# EAGLE design AloyseTech-ELVN-RevA (EAGLE 9.3.2)
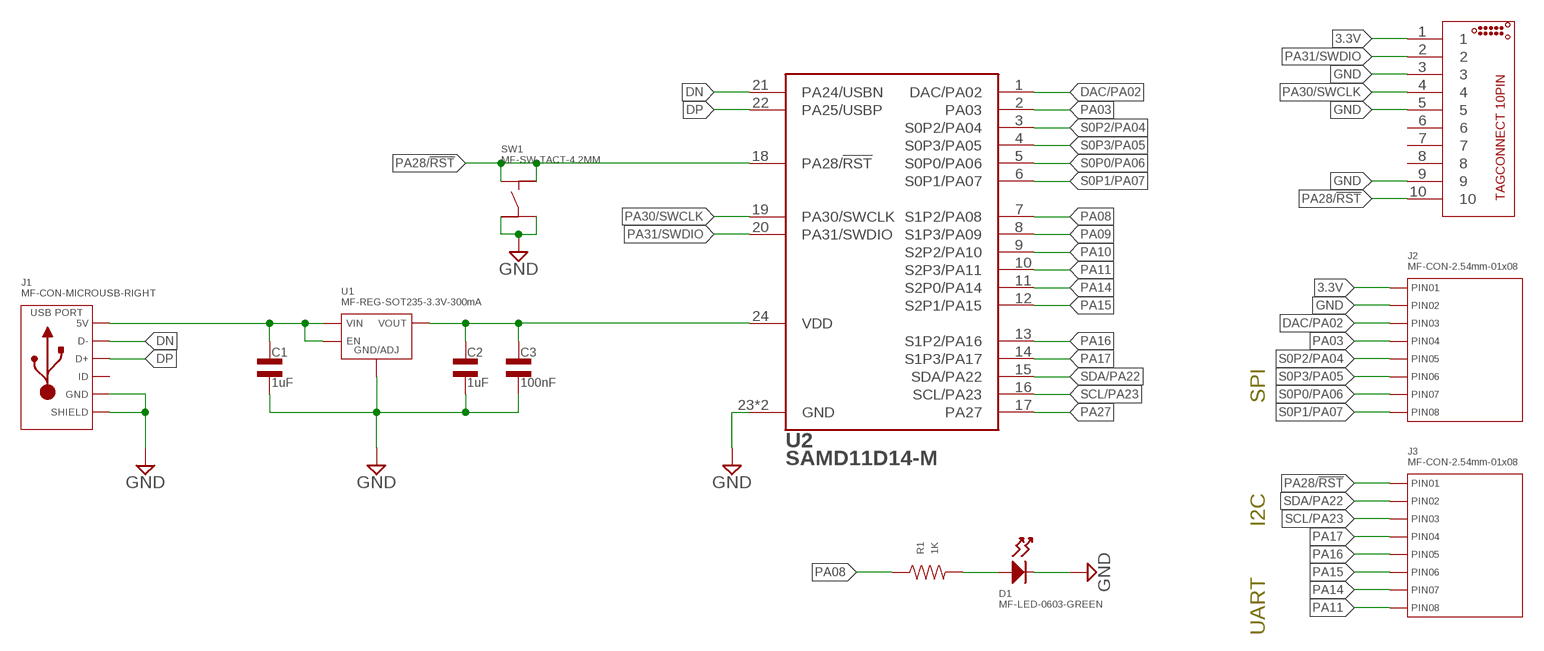
[diagram p0: schematic, sheet 1]

## Parts
C1  1uF  CAPACITOR-NP-COG-10V-0805  [0805]
C2  1uF  CAPACITOR-NP-COG-10V-0805  [0805]
C3  100nF  CAPACITOR-NP-COG-10V-0402  [0402]
D1  MF-LED-0603-GREEN  LED_SINGLE-0603-GREEN  [LED0603]
J1  MF-CON-MICROUSB-RIGHT  USB_MICRO_RIGHT  [MICROUSB-RIGHT]
J2  MF-CON-2.54mm-01x08  CON_01X08_PTH_2.54MM  [PTH_2.54MM_01X08]
J3  MF-CON-2.54mm-01x08  CON_01X08_PTH_2.54MM  [PTH_2.54MM_01X08]
J4  TC2050-COMBO-NC  [TC2050-10PIN1.27MM-COMBO-NC]
R1  1K  RESISTOR_0402  [R0402]
SW1  MF-SW-TACT-4.2MM  TACT_4.2MM  [TACT4.2MM]
U1  MF-REG-SOT235-3.3V-300mA  TLV70233PDBVR  [SOT-23-5]
U2  SAMD11D14-M  [QFN50P400X400X90-25T275]

## Nets
3.3V: C2.1 C3.1 J2.P$1(PIN1) J4.1 U1.P$5(VOUT) U2.24(VDD)
DAC/PA02: J2.P$3(PIN3) U2.1(DAC/PA02)
DN: J1.2(D-) U2.21(PA24/USBN)
DP: J1.3(D+) U2.22(PA25/USBP)
GND: C1.2 C2.2 C3.2 D1.CATHODE J1.5(GND) J1.S1(SLD) J1.S2(SLD) J1.S3(SLD) J1.S4(SLD) J1.S5(SLD) J1.S6(SLD) J2.P$2(PIN2) J4.3 J4.5 J4.9 SW1.P$3 SW1.P$4 U1.P$2(GND/ADJ) U2.23(GND) U2.25(GND)
N$1: D1.ANODE R1.P$2
PA03: J2.P$4(PIN4) U2.2(PA03)
PA08: R1.P$1 U2.7(S1P2/PA08)
PA09: U2.8(S1P3/PA09)
PA10: U2.9(S2P2/PA10)
PA11: J3.P$8(PIN8) U2.10(S2P3/PA11)
PA14: J3.P$7(PIN7) U2.11(S2P0/PA14)
PA15: J3.P$6(PIN6) U2.12(S2P1/PA15)
PA16: J3.P$5(PIN5) U2.13(S1P2/PA16)
PA17: J3.P$4(PIN4) U2.14(S1P3/PA17)
PA27: U2.17(PA27)
PA28/!RST!: J3.P$1(PIN1) J4.10 SW1.P$1 SW1.P$2 U2.18(PA28/!RST!)
PA30/SWCLK: J4.4 U2.19(PA30/SWCLK)
PA31/SWDIO: J4.2 U2.20(PA31/SWDIO)
S0P0/PA06: J2.P$7(PIN7) U2.5(S0P0/PA06)
S0P1/PA07: J2.P$8(PIN8) U2.6(S0P1/PA07)
S0P2/PA04: J2.P$5(PIN5) U2.3(S0P2/PA04)
S0P3/PA05: J2.P$6(PIN6) U2.4(S0P3/PA05)
SCL/PA23: J3.P$3(PIN3) U2.16(SCL/PA23)
SDA/PA22: J3.P$2(PIN2) U2.15(SDA/PA22)
VBUS: C1.1 J1.1(5V) U1.P$1(VIN) U1.P$3(EN)
Unconnected: J1.4(ID) J4.6 J4.7 J4.8

## Notes on the sheet
- SPI
- I2C
- UART

## Library data of the parts
C1 C2 = Generics_stg:CAPACITOR-NP; CLASS: COG; PACKAGE: 0805; POPULATE: 1; TOLERANCE: xx %; VOLTAGE: 10V
C3 = Generics_stg:CAPACITOR-NP; CLASS: COG; PACKAGE: 0402; POPULATE: 1; TOLERANCE: xx %; VOLTAGE: 10V
D1 = MF_LEDs:LED_SINGLE: Library: MF_LEDs Description: Device for Single LED Packages. Manufacture part number (MFG#) can be added via Attributes.; HOUSEPART: YES; MPN: MF-LED-0603-GREEN; POPULATE: 1; URL: https://factory.macrofab.com/part/MF-LED-0603-GREEN
J1 = MF_Connectors:USB: Library: MF_Connectors Description: 5 Pin USB Connectors. SLD is the shield connection. Usually tied to ground through a small ferrite bead.; HOUSEPART: YES; MPN: MF-CON-MICROUSB-RIGHT; POPULATE: 1; URL: https://factory.macrofab.com/part/MF-CON-MICROUSB-RIGHT
J2 J3 = MF_Connectors:CON_01X08: Library: MF_Connectors Description: Header Connector with 8 Positions and 01 Rows. Use the LABEL Attribute to label the pin on the schematic and PCB. You can remove the attributes on the PCB by using the SMASH function on the part and then deleting the text.; HOUSEPART: YES; MPN: MF-CON-2.54mm-01x08; POPULATE: 1; URL: https://factory.macrofab.com/part/MF-CON-2.54mm-01x08
J4 = TagConnect_stg:TC2050
R1 = MF_Passives:RESISTOR: Library: MF_Passives Description: Device for Resistors. Manufacture part number (MPN), Voltage, Tolerance, and Wattage Rating can be added via Attributes. Check https://factory.macrofab.com/parts for the house parts list.; POPULATE: 1
SW1 = MF_Switches:TACT: Library: MF_Switches Description: Device for Tact Switches. Manufacture part number (MFG#) can be added via Attributes.; HOUSEPART: YES; MPN: MF-SW-TACT-4.2MM; POPULATE: 1; URL: https://factory.macrofab.com/part/MF-SW-TACT-4.2MM
U1 = MF_IC_Power:TLV702: Manufacturer Part #: TLV702 Manufacturer: Texas Instruments Description: LDO Voltage Regulators; HOUSEPART: YES; MPN: MF-REG-SOT235-3.3V-300mA; POPULATE: 1; URL: https://factory.macrofab.com/part/MF-REG-SOT235-3.3V-300mA
U2 = MICROCHIP:SAMD11D14-M

## Board
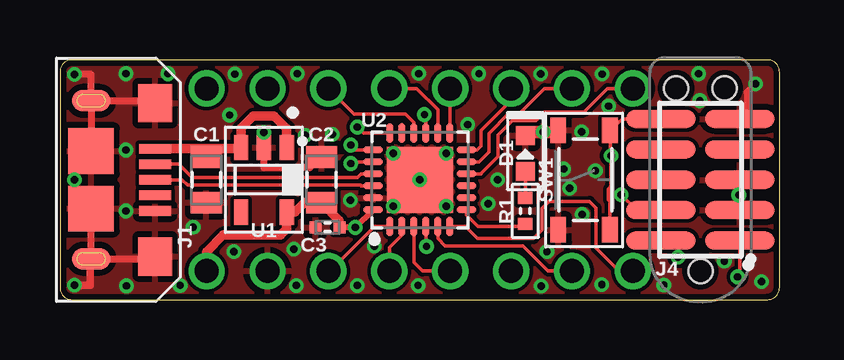
[diagram p1: board, top side]
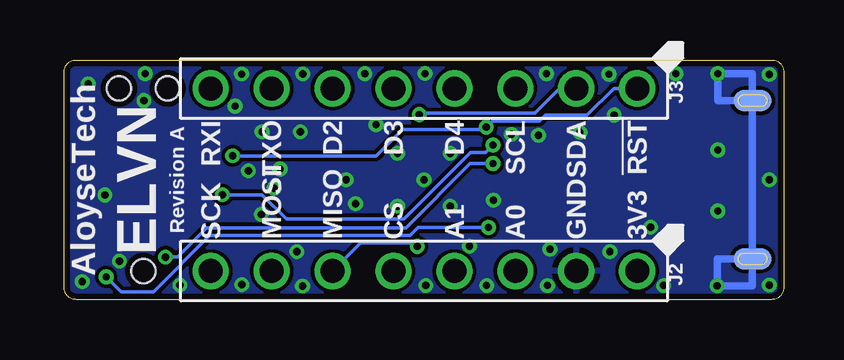
[diagram p2: board, bottom side, seen from below]

Size 30 x 10 mm. Coordinates in mm from the lower left corner, seen from the top.
Outline: 0,9.5 0,0.5 arc90 0.5,0 29.5,0 arc90 30,0.5 30,9.5 arc90 29.5,10 0.5,10 arc90 0,9.5
Copper layers (1*16): Top 0.035mm / dielectric 1.5mm / Bottom 0.035mm
Design rules "SeeedStudio_2layer_DRU_no_angle_20140221": minimum track width 6mil, minimum drill 12mil, track to track 6mil, track to pad 6mil, pad to pad 6mil, via to via 6mil, smd to smd 0mil, copper to edge 10mil, drill to drill 10mil, minimum pad ring 10mil, minimum via ring 6mil, stop-mask expansion 2mil, vias tented up to drill 100mil, thermal gap 10mil

### Footprints (pad centres in the part's own frame; a part is rotated, then mirrored left to right if it is on the bottom)
0805 = smd 0.9 x 1.3: 1 -0.95,0; 2 0.95,0
0402 = smd 0.5 x 0.5: 1 -0.5,0; 2 0.5,0
LED0603 = smd 0.8 x 0.8: ANODE 0.75,0; CATHODE -0.75,0
MICROUSB-RIGHT = smd 0.4 x 1.35: 1 -1.3,1.27; 2 -0.65,1.27; 3 0,1.27; 4 0.65,1.27; 5 1.3,1.27 | smd 0.9 x 1.6: S1 -3.3,-1.4; S2 3.3,-1.4 | smd 1.6 x 1.4: S3 -3.2,1.27; S4 3.2,1.27 | smd 1.9 x 1.9: S5 -1.2,-1.405; S6 1.2,-1.405 | smd 0.9 x 1.6 bottom: S7 -3.3,-1.4; S8 3.3,-1.4
PTH_2.54MM_01X08 = drill 1: P$1 -8.89,0; P$2 -6.35,0; P$3 -3.81,0; P$4 -1.27,0; P$5 1.27,0; P$6 3.81,0; P$7 6.35,0; P$8 8.89,0
TC2050-10PIN1.27MM-COMBO-NC = smd 0.75 x 2.9: 1 -2.54,-1.65; 2 -2.54,1.65; 3 -1.27,-1.65; 4 -1.27,1.65; 5 0,-1.65; 6 0,1.65; 7 1.27,-1.65; 8 1.27,1.65; 9 2.54,-1.65; 10 2.54,1.65 | hole 1: -3.81,0; 3.81,-1.016; 3.81,1.016
R0402 = smd 0.5 x 0.6: P$1 -0.55,0; P$2 0.55,0
TACT4.2MM = smd 1.05 x 0.65: P$1 -2.075,1.075; P$2 2.075,1.075; P$3 -2.075,-1.075; P$4 2.075,-1.075
SOT-23-5 = smd 1.05 x 0.6: P$1 -1.35,0.95; P$2 -1.35,0; P$3 -1.35,-0.95; P$4 1.35,-0.95; P$5 1.35,0.95
QFN50P400X400X90-25T275 = smd 0.811 x 0.264: 1 -1.951,1.25; 2 -1.951,0.75; 3 -1.951,0.25; 4 -1.951,-0.25; 5 -1.951,-0.75; 6 -1.951,-1.25; 13 1.951,-1.25; 14 1.951,-0.75; 15 1.951,-0.25; 16 1.951,0.25; 17 1.951,0.75; 18 1.951,1.25 | smd 0.264 x 0.811: 7 -1.25,-1.951; 8 -0.75,-1.951; 9 -0.25,-1.951; 10 0.25,-1.951; 11 0.75,-1.951; 12 1.25,-1.951; 19 1.25,1.951; 20 0.75,1.951; 21 0.25,1.951; 22 -0.25,1.951; 23 -0.75,1.951; 24 -1.25,1.951 | smd 2.75 x 2.75: 25 0,0

### Placement (x,y rotation side)
C1  6.1,5 270 top
C2  10.9,5 90 top
C3  11.15,3.01 180 top
D1  19.4,6.1 270 top
J1  2.7,5 270 top
J2  15,1.19 180 bottom
J3  15,8.81 180 bottom
J4  26.7,5 90 top
R1  19.4,3.7 90 top
SW1  21.85,4.99 270 top
U1  8.5,5 270 top
U2  15,5 90 top

### Tracks (layer width: path | path; a pad name or v marks a point on that pad's centre or on a via)
3.3V  (via drill 0.3)
  Top 0.152: J4.1 28.35,1.05 v28.25,0.95
  Top 0.254: 11.2,3.75 C2.1 | U2.24 v12.31,3.01 C3.1
  Top 0.4: C3.1 11.64,3.31 C2.1 10.2,4.05 9.8,3.65 U1.P$5 9.45,2.95 9.19,2.69 6.81,2.69 6.11,1.99 J2.P$1
  Bottom 0.152: v28.25,0.95 27.63,0.33 26.27,0.33 23.93,2.67 15.58,2.67 15.24,3.01 v12.31,3.01
DAC/PA02
  Top 0.152: U2.1 13.12,3.05 11.27,1.19 J2.P$3
DN
  Top 0.152: U2.21 12.55,5.25 12.4,5.1 5.5,5.1 4.95,5.65 J1.2
DP
  Top 0.152: J1.3 5.1,5 5.33,4.78 12.52,4.78 12.55,4.75 U2.22
GND  (via drill 0.3)
  Top 0.3: J1.S6 J1.S2 3.87,1.7 J1.S4 | J1.S1 | J1.S1 1.4,8.2 | J1.S1 3.87,8.3 J1.S3 | J1.S1 J1.S5 | J1.S1 1.3,9.4 v0.6,9.4 | J4.9 28.65,7.54 28.65,8.65 v29,9 | C2.2 10.87,5.95 10.42,5.5 8.5,5.5 U1.P$2
  Top 0.305: v0.6,0.6 1.25,0.6 1.25,1.7 J1.S2
  Top 0.4: U1.P$2 v8.5,6.97
  Top 0.508: D1.CATHODE 19.55,7 20.05,7 20.06,7 v20.15,7 20.71,7 SW1.P$3
  Bottom 0.305: J1.S2 1.3,0.58 v2.77,0.58 2.77,1.7 J1.S2 | J1.S1 1.3,9.43 v2.75,9.43 2.75,8.3 J1.S1 | J1.S1 J1.S2
  other vias: 21.25,4.65 12.1,4.15 15,5 13.9,6.1 16.1,6.1 16.1,3.9 13.9,3.9 5.55,3.02 28.3,4.37 21.75,7 22.88,8.07 20.05,9.42 22.6,9.41 26.62,9.43 17.46,9.43 14.96,9.43 9.89,9.43 7.29,9.41 4.5,9.43 0.6,5 20.06,0.57 22.59,0.62 25.18,0.6 17,7.3 18.25,5 29.25,0.75 27.7,1.6 21.77,3.55 22.32,5.38 21,5.45 26.68,8.3 17.85,4 13.1,2.23 9.75,2.1 7.25,2 7.08,7.7 2.75,3.7 10.22,6.85 11.35,6.9 20.3,2 14.93,0.59 12.39,0.59 9.85,0.59 5.01,0.59 2.75,6.24
  pour Top: -3,13 33,13 33,-3 -3,-3
  pour Bottom: -2,12 32,12 32,-2 -2,-2
N$1
  Top 0.152: D1.ANODE R1.P$2
PA03
  Top 0.152: U2.2 14.25,2.7 13.73,2.18 J2.P$4
PA08
  Top 0.152: U2.7 16.95,3.52 17.43,3.05 19.3,3.05 R1.P$1
PA11
  Top 0.152: U2.10 17.55,5.25 18.25,5.96 18.25,6.87 18.87,7.48 19.85,7.48 20.2,7.83 21.84,7.83 22.82,8.81 J3.P$8
PA14
  Top 0.152: U2.11 17.48,5.75 17.88,6.15 17.88,6.93 18.73,7.78 19.18,7.78 20.2,8.81 J3.P$7
PA15
  Top 0.152: U2.12 17.4,6.25 17.55,6.4 17.55,7.05 18.81,8.31 J3.P$6
PA16
  Top 0.152: U2.13 16.25,8.79 J3.P$5
PA17
  Top 0.152: U2.14 15.75,7.92 14.87,8.81 J3.P$4
PA27
  Top 0.152: U2.17 14.25,7.3
PA28/!RST!  (via drill 0.3)
  Top 0.152: U2.18 12.65,6.95 v12.4,7.2 | J4.10 23.44,7.54 SW1.P$1 v22.98,6 22.98,4.73 22.87,4.62 22.87,4.15 22.93,4.1 SW1.P$2
  Bottom 0.152: v22.98,6 17,6 15.9,7.1 12.5,7.1 v12.4,7.2 12.15,7.45 10.18,7.45 9.93,7.7 8.2,7.7 7.09,8.81 J3.P$1
PA30/SWCLK  (via drill 0.3)
  Top 0.152: U2.19 12.32,6.25 v12.12,6.45 | J4.4 24.05,3.73 v23.4,4.38
  Bottom 0.152: v12.12,6.45 12.44,6.13 13.06,6.13 15.84,3.35 20.73,3.35 21.75,4.38 v23.4,4.38
PA31/SWDIO  (via drill 0.3)
  Top 0.152: U2.20 12.12,5.75 v12.12,5.67 | v25.77,1.77 25.77,2.23 25.54,2.46 J4.2
  Bottom 0.152: v12.12,5.67 13.07,5.67 15.75,3 24.05,3 25.27,1.77 v25.77,1.77
S0P0/PA06
  Top 0.152: U2.5 15.75,2.55 16.06,2.24 19.3,2.24 20.35,1.19 J2.P$7
S0P1/PA07
  Top 0.152: U2.6 16.9,3.05 17.4,2.55 19.75,2.55 20.1,2.9 20.1,3.81 20.39,4.1 22.08,4.1 22.35,3.83 22.35,2.15 23.31,1.19 J2.P$8
S0P2/PA04
  Top 0.152: U2.3 14.75,1.55 15.11,1.19 J2.P$5
S0P3/PA05  (via drill 0.3)
  Top 0.152: U2.4 15.25,2.25 v15.28,2.22
  Bottom 0.152: J2.P$6 17.63,2.37 15.43,2.37 v15.28,2.22
SCL/PA23
  Top 0.152: U2.16 14.75,7.39 14.4,7.74 12.26,7.74 J3.P$3
SDA/PA22  (via drill 0.3)
  Top 0.152: U2.15 15.25,7.66 v15.2,7.72
  Bottom 0.152: v15.2,7.72 15.13,7.78 10.38,7.78 9.35,8.81 J3.P$2
VBUS
  Top 0.4: J1.1 6.1,6.3 | 6.1,6.3 C1.1 | 6.1,6.3 7.55,6.3 U1.P$3 7.55,7.15 8.06,7.66 8.93,7.66 9.45,7.14 U1.P$1

### Text on the board
_bsilk: !RST! | SDA | SCL | D4 | D3 | D2 | TXO | RXI | Revision A | ELVN | AloyseTech | 3V3 | GND | A0 | A1 | CS | MISO | MOSI | SCK